# Altium schematic sheet Power.SchDoc
size A4
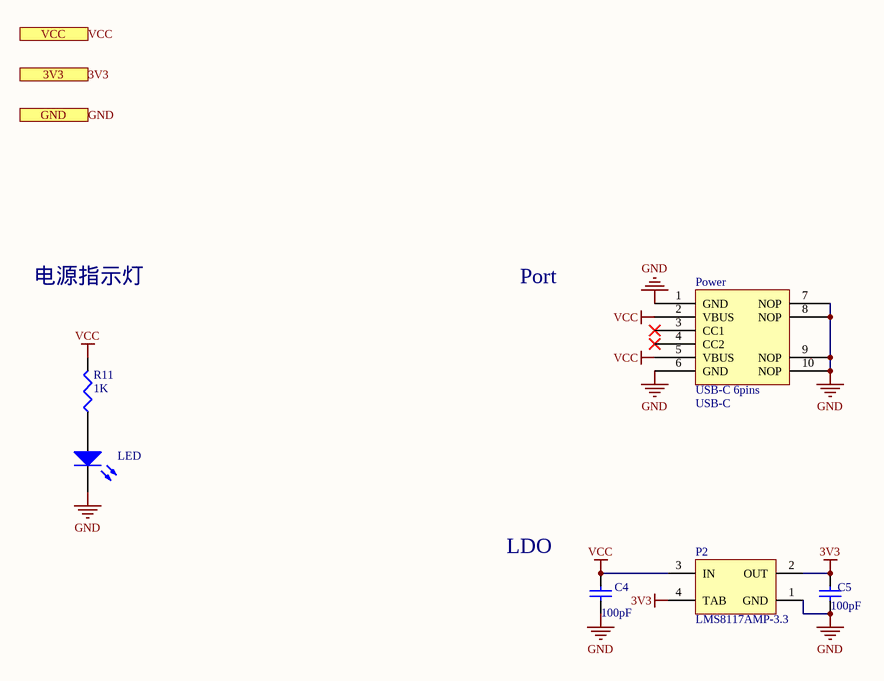
[diagram p0: Power.SchDoc]

## Parts
C4  value 100pF  [6-0805_N]  (hidden comment: Cap)
C5  value 100pF  [6-0805_N]  (hidden comment: Cap)
LED  LED3  [6-0805_N]  (value not drawn)
P2  LMS8117AMP-3.3  [MP04A_N]
Power  USB-C  [USB-C]
R11  value 1K  [6-0805_N]  (hidden comment: Res3)

## Ports
3V3, GND, VCC

## Nets
3V3: C5.2 P2.2(OUT) P2.4(TAB) ; port 3V3
GND: C4.1 C5.1 LED.2(K) P2.1(GND) Power.1(GND) Power.6(GND) Power.7(NOP) Power.8(NOP) Power.9(NOP) Power.10(NOP) ; port GND
VCC: C4.2 P2.3(IN) Power.2(VBUS) Power.5(VBUS) R11.2 ; port VCC
NetLED_1: LED.1(A) R11.1

Not connected (* = marked no-connect by the designer): Power 3(CC1)* 4(CC2)*

## Notes on the sheet
- 电源指示灯
- Port
- LDO
- (in symbol USB-C) USB-C 6pins

## Library data of the parts
C4 C5 = Cap: Capacitor; Published: 8-Jun-2000; LatestRevisionDate: 17-Jul-2002; LatestRevisionNote: Re-released for DXP Platform.; PackageReference: RAD-0.3; Publisher: Altium Limited; PackageDescription: Radial Cap, Thru-Hole; 2 Leads; 0.3 in Pin Spacing
LED = LED3: Typical BLUE SiC LED; Published: 8-Jun-2000; LatestRevisionDate: 17-Dec-2003; LatestRevisionNote: PCB Footprint replaced.; DatasheetVersion: 16-Apr-2002; PackageVersion: 16-Apr-2002; PackageReference: 3.5X2.8X1.9; Publisher: Altium Limited; PackageDescription: SM LED; 2 C-Bend Leads; Body 3.5 x 2.8 x 1.9 mm, inc leads (LxWxH typ)
P2 = LMS8117AMP-3.3: 1A Low-Dropout Linear Regulator, 4-pin SOT-223; Manufacturer: National Semiconductor; PackageTopMarking: XYTT*LS01; PowerWise: N; CompType: LDO IC; High-Reliability: Y; DatasheetVersion: Apr-2005; PackageVersion: revB, Apr-2003; PackageReference: MP04A; PackageDescription: Molded SOT-223, 6.50 x 3.56 x 1.6mm Body, 4 Lead, 2.3mm Pitch; PartNumber: LMS8117AMP-3.3; RoHS: N; PinCount: 4; Code_JEDEC: TO-261-AA; Code_IPC: SOT223-4; ComponentLink1Description: Manufacturer URL; ComponentLink1URL: http://www.national.com/; ComponentLink2Description: LMS8117A Datasheet; ComponentLink2URL: http://www.national.com/ds/LM/LMS8117A.pdf; ComponentLink3Description: LMS8117A Web Page; ComponentLink3URL: http://www.national.com/pf/LM/LMS8117A.html; ComponentLink4Description: MP04A Package Page; ComponentLink4URL: http://www.national.com/packaging/folders/mp04a.html
R11 = Res3: Resistor; Published: 8-Jun-2000; LatestRevisionDate: 29-May-2009; LatestRevisionNote: IPC-7351 Footprint Added.; PackageReference: J1-0603; Publisher: Altium Limited; PackageDescription: Chip Resistor